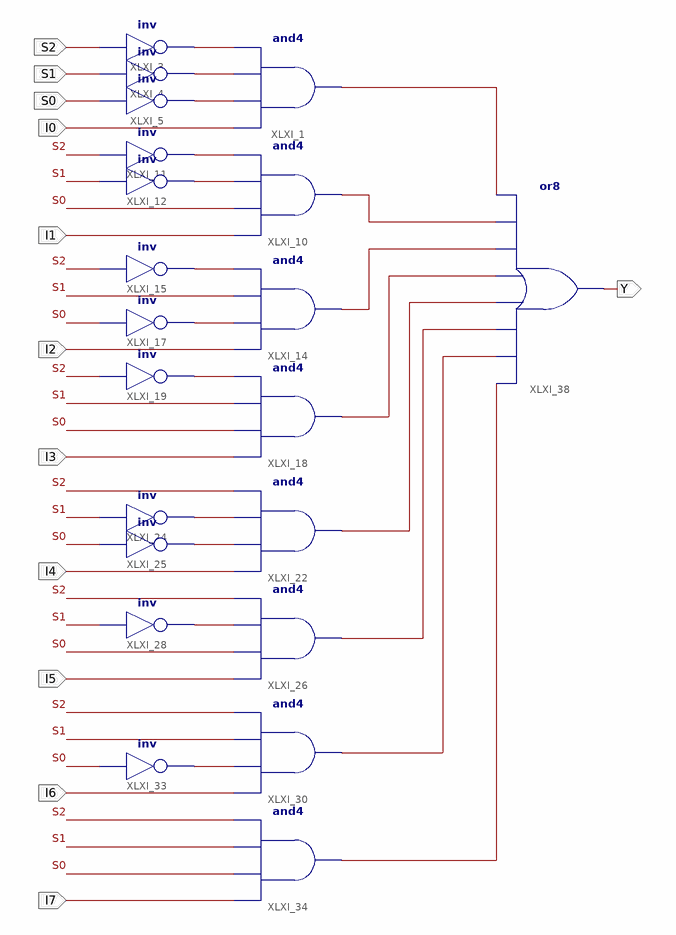
[diagram p0: schematic sheet 1]
// Xilinx ISE schematic multiplexer_8_to_1.sch (virtex6) as structural Verilog: 21 symbols, 12 ports
module multiplexer_8_to_1 (
  input  S2,
  input  S1,
  input  S0,
  input  I7,
  input  I6,
  input  I5,
  input  I4,
  input  I3,
  input  I2,
  input  I1,
  input  I0,
  output Y
);

  wire XLXN_1, XLXN_2, XLXN_3, XLXN_5, XLXN_26, XLXN_27, XLXN_34, XLXN_36, XLXN_38, XLXN_42, XLXN_46,
       XLXN_51, XLXN_52, XLXN_54, XLXN_59, XLXN_62, XLXN_68, XLXN_78, XLXN_83, XLXN_88;

  and XLXI_1 (XLXN_5, I0, XLXN_3, XLXN_2, XLXN_1);
  not XLXI_3 (XLXN_1, S2);
  not XLXI_4 (XLXN_2, S1);
  not XLXI_5 (XLXN_3, S0);
  and XLXI_10 (XLXN_83, I1, S0, XLXN_27, XLXN_26);
  not XLXI_11 (XLXN_26, S2);
  not XLXI_12 (XLXN_27, S1);
  and XLXI_14 (XLXN_38, I2, XLXN_36, S1, XLXN_34);
  not XLXI_17 (XLXN_36, S0);
  and XLXI_18 (XLXN_46, I3, S0, S1, XLXN_42);
  not XLXI_19 (XLXN_42, S2);
  and XLXI_22 (XLXN_54, I4, XLXN_52, XLXN_51, S2);
  not XLXI_24 (XLXN_51, S1);
  not XLXI_25 (XLXN_52, S0);
  and XLXI_26 (XLXN_62, I5, S0, XLXN_59, S2);
  not XLXI_28 (XLXN_59, S1);
  and XLXI_30 (XLXN_88, I6, XLXN_68, S1, S2);
  not XLXI_33 (XLXN_68, S0);
  and XLXI_34 (XLXN_78, I7, S0, S1, S2);
  not XLXI_15 (XLXN_34, S2);
  or XLXI_38 (Y, XLXN_78, XLXN_88, XLXN_62, XLXN_54, XLXN_46, XLXN_38, XLXN_83, XLXN_5);
endmodule
